# EAGLE schematic untitled (EAGLE 9.6.1)
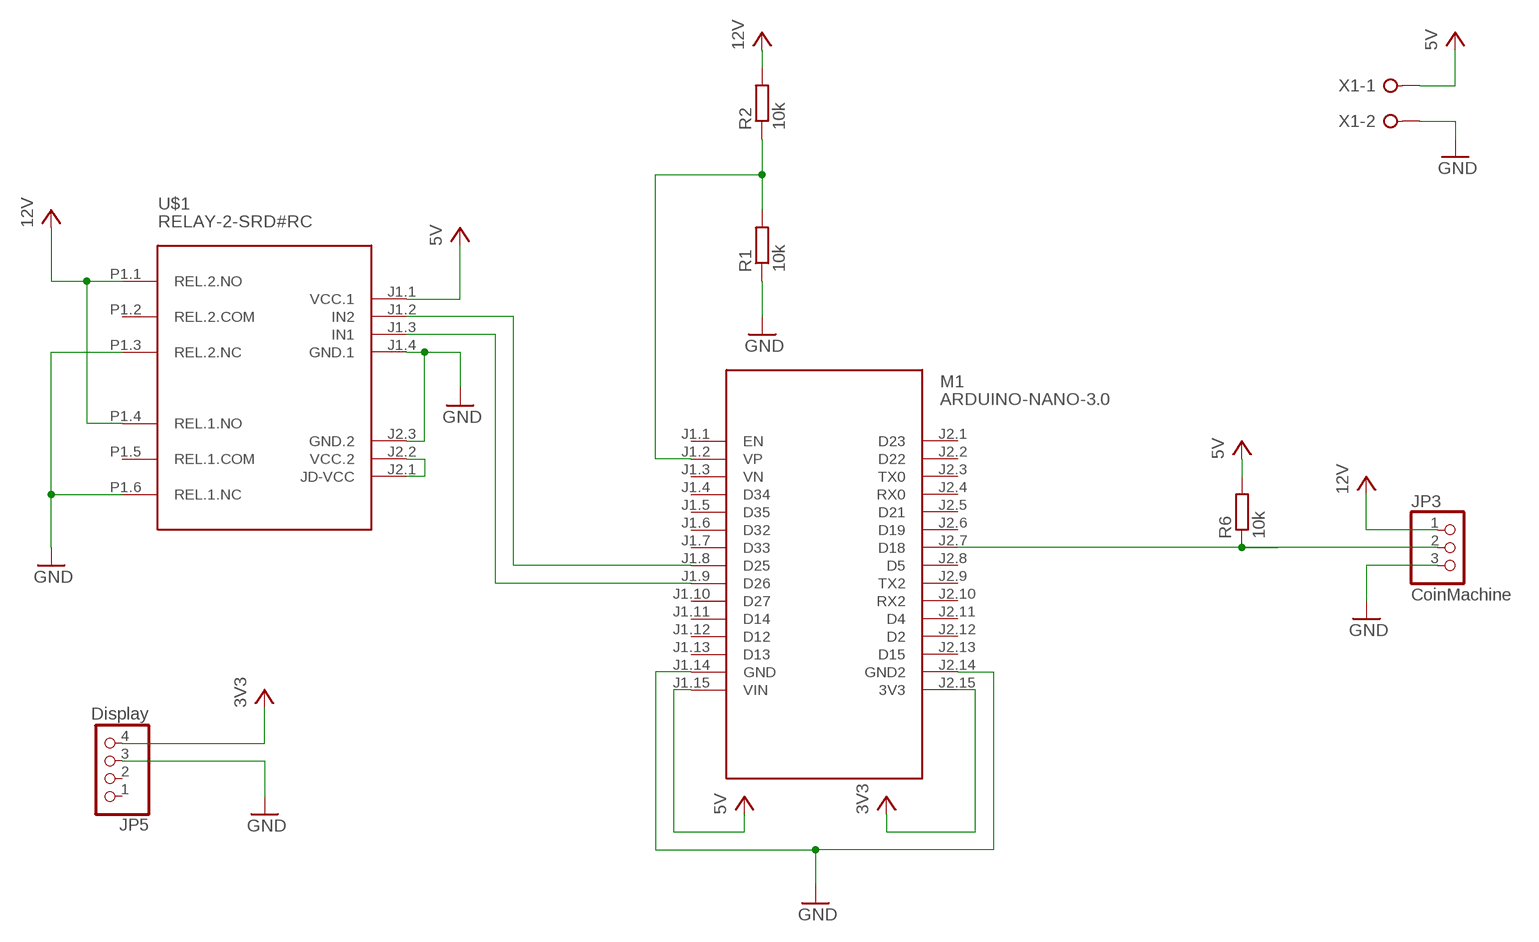
[diagram p0: schematic, sheet 1]

## Parts
JP3  CoinMachine  PINHD-1X3/90  [1X03/90]
JP5  Display  PINHD-1X4  [1X04]
M1  ARDUINO-NANO-3.0  [ARDUINO-NANO-3.0]
R1  10k  R-EU_0207/10  [0207/10]
R2  10k  R-EU_0207/10  [0207/10]
R6  10k  R-EU_0207/10  [0207/10]
U$1  RELAY-2-SRD#RC  [RELAY-2-SRD#RC]
X1  W237-02P  [W237-132]

## Nets
GND: JP3.3 JP5.3 M1.J1.14(GND) M1.J2.14(GND2) R1.1 U$1.J1.4(GND.1) U$1.J2.3(GND.2) U$1.P1.3(REL.2.NC) U$1.P1.6(REL.1.NC) X1.2
N$1: JP3.2 M1.J2.7(D18) R6.1
N$2: M1.J1.2(VP) R1.2 R2.1
N$3: M1.J1.8(D25) U$1.J1.2(IN2)
N$4: M1.J1.9(D26) U$1.J1.3(IN1)
N$5: U$1.J2.1(JD-VCC) U$1.J2.2(VCC.2)
VCC: JP3.1 JP5.4 M1.J1.15(VIN) M1.J2.15(3V3) R2.2 R6.2 U$1.J1.1(VCC.1) U$1.P1.1(REL.2.NO) U$1.P1.4(REL.1.NO) X1.1 ; supply symbol labelled 3V3, 5V, 12V
Unconnected: JP5.1 JP5.2 M1.J1.1(EN) M1.J1.3(VN) M1.J1.4(D34) M1.J1.5(D35) M1.J1.6(D32) M1.J1.7(D33) M1.J1.10(D27) M1.J1.11(D14) M1.J1.12(D12) M1.J1.13(D13) M1.J2.1(D23) M1.J2.2(D22) M1.J2.3(TX0) M1.J2.4(RX0) M1.J2.5(D21) M1.J2.6(D19) M1.J2.8(D5) M1.J2.9(TX2) M1.J2.10(RX2) M1.J2.11(D4) M1.J2.12(D2) M1.J2.13(D15) U$1.P1.2(REL.2.COM) U$1.P1.5(REL.1.COM)

## Library data of the parts
JP3 = pinhead:PINHD-1X3: PIN HEADER
JP5 = pinhead:PINHD-1X4: PIN HEADER
M1 = diy-modules:ARDUINO-NANO-3.0: Arduino Nano 3.0
R1 R2 R6 = resistor:R-EU_: RESISTOR, European symbol
U$1 = diy-modules:RELAY-2-SRD#RC: 2-Channel Relay Module based on SRD-05VDC-SL-C relays Symbol with relays pins
X1 = con-wago-508:W237-02P: WAGO SREW CLAMP; OC_FARNELL: unknown; OC_NEWARK: unknown